# EAGLE schematic audino1012 (EAGLE 6.2)
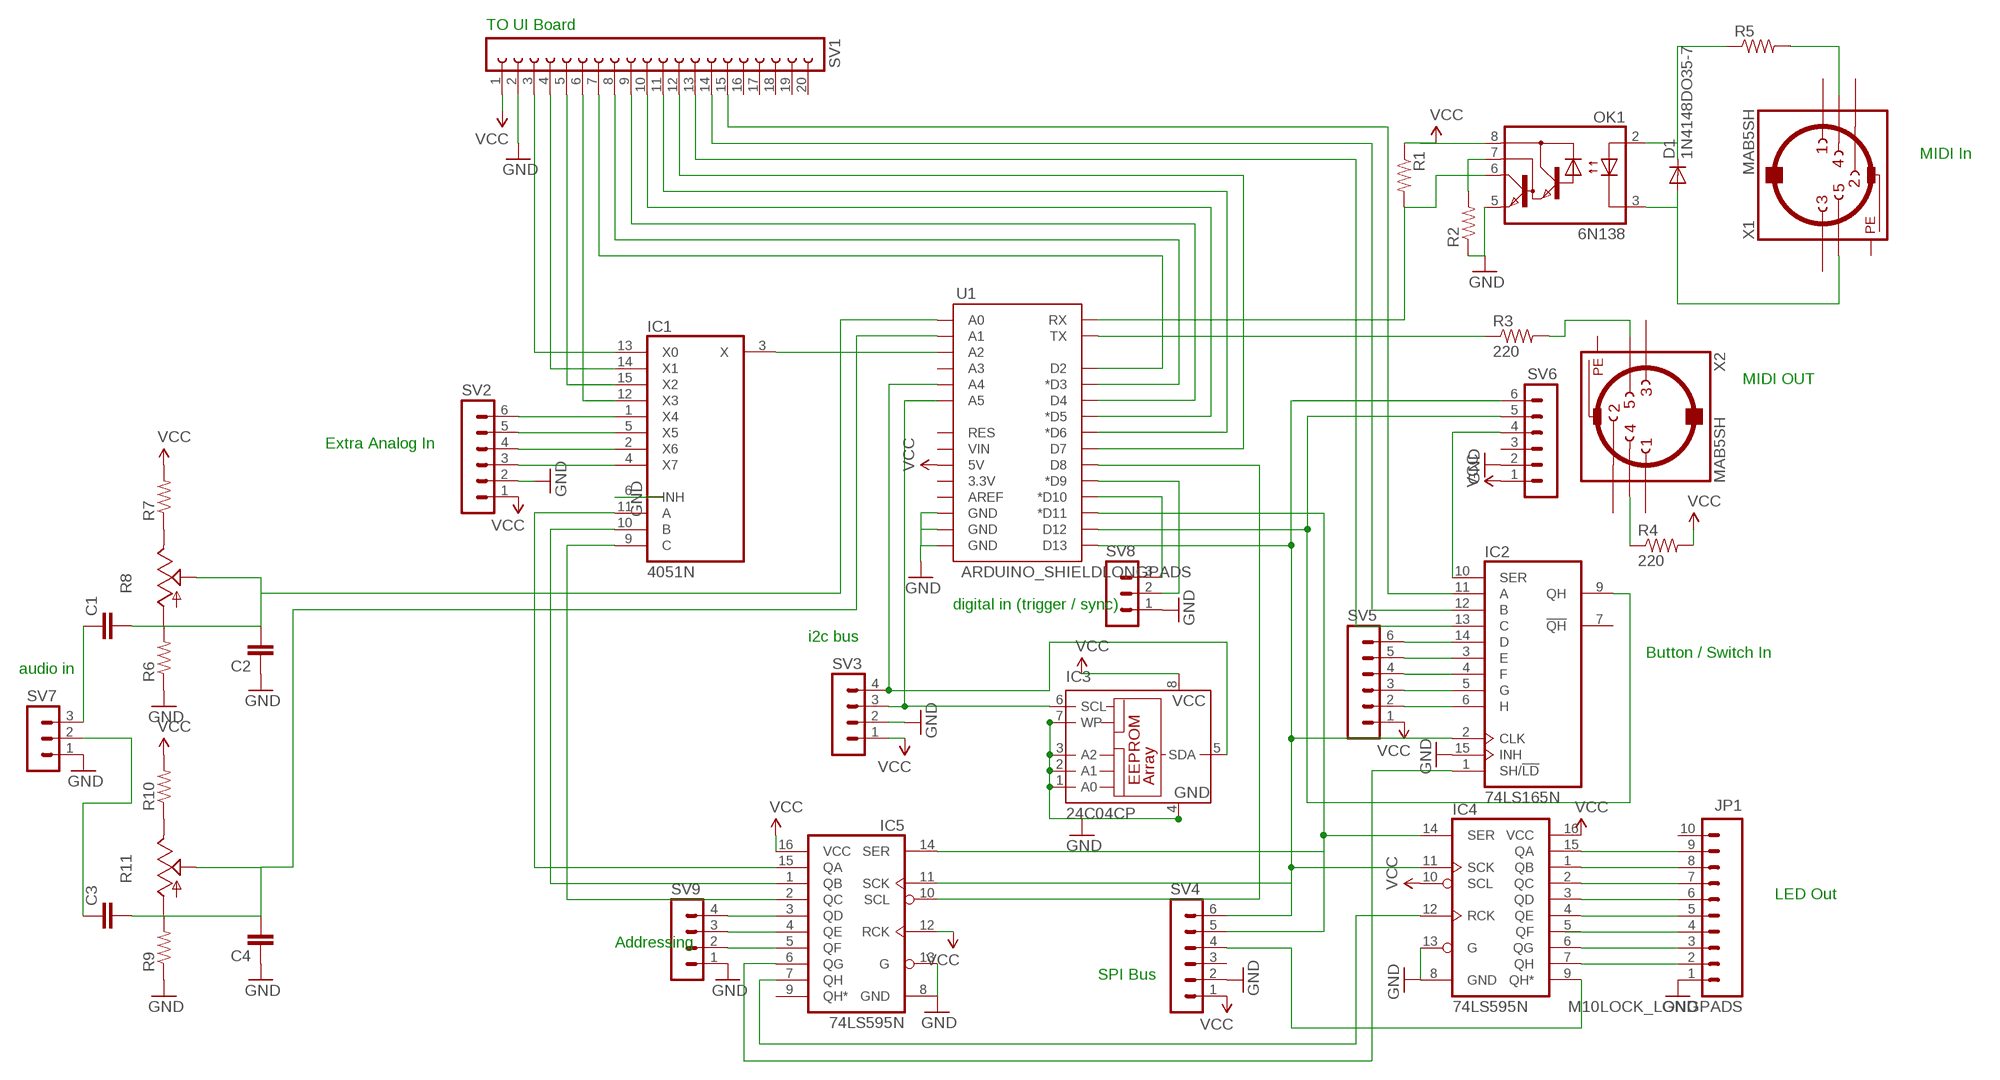
[diagram p0: schematic, sheet 1]

## Parts
C1  CAPPTH  [CAP-PTH-SMALL]
C2  CAPPTH  [CAP-PTH-SMALL]
C3  CAPPTH  [CAP-PTH-SMALL]
C4  CAPPTH  [CAP-PTH-SMALL]
D1  1N4148DO35-7  [DO35-7]
IC1  4051N  [DIL16]
IC2  74LS165N  [DIL16]
IC3  24C04CP  [DIL8]
IC4  74LS595N  [DIL16]
IC5  74LS595N  [DIL16]
JP1  M10LOCK_LONGPADS  [1X10_LOCK_LONGPADS]
OK1  6N138  [DIL08]
R1  RESISTORKIT  [AXIAL-0.3-KIT]
R2  RESISTORKIT  [AXIAL-0.3-KIT]
R3  220  RESISTORKIT  [AXIAL-0.3-KIT]
R4  220  RESISTORKIT  [AXIAL-0.3-KIT]
R5  RESISTORKIT  [AXIAL-0.3-KIT]
R6  RESISTORKIT  [AXIAL-0.3-KIT]
R7  RESISTORKIT  [AXIAL-0.3-KIT]
R8  TRIM_US-B64Y  [B64Y]
R9  RESISTORKIT  [AXIAL-0.3-KIT]
R10  RESISTORKIT  [AXIAL-0.3-KIT]
R11  TRIM_US-B64Y  [B64Y]
SV1  FE20-1  [FE20]
SV2  MA06-1  [MA06-1]
SV3  MA04-1  [MA04-1]
SV4  MA06-1  [MA06-1]
SV5  MA06-1  [MA06-1]
SV6  MA06-1  [MA06-1]
SV7  MA03-1  [MA03-1]
SV8  MA03-1  [MA03-1]
SV9  MA04-1  [MA04-1]
U1  ARDUINO_SHIELDLONGPADS  [DUEMILANOVE_SHIELD_LONGPADS]
X1  MAB5SH  [MAB5SH]
X2  MAB5SH  [MAB5SH]

## Nets
GND: C2.1 C4.1 IC1.6(INH) IC2.15(INH) IC3.1(A0) IC3.2(A1) IC3.3(A2) IC3.4(GND) IC3.7(WP) IC4.8(GND) IC4.13(G) IC5.8(GND) IC5.13(G) JP1.1 OK1.5(GND) R2.P$1 R6.P$1 R9.P$1 SV1.2 SV2.2 SV3.2 SV4.2 SV6.2 SV7.1 SV8.1 SV9.1 U1.GND@0(GND) U1.GND@1(GND) U1.GND@2(GND)
N$1: IC1.13(X0) SV1.3
N$2: IC1.14(X1) SV1.4
N$3: IC1.15(X2) SV1.5
N$4: IC1.12(X3) SV1.6
N$5: IC1.3(X) U1.A2
N$6: IC1.1(X4) SV2.6
N$7: IC1.5(X5) SV2.5
N$8: IC1.2(X6) SV2.4
N$9: IC1.4(X7) SV2.3
N$10: SV1.7 U1.D2
N$11: SV1.8 U1.D3(*D3)
N$12: SV1.9 U1.D4
N$13: SV1.10 U1.D5(*D5)
N$14: SV1.11 U1.D6(*D6)
N$15: SV1.12 U1.D7
N$16: IC3.5(SDA) SV3.4 U1.A4
N$17: IC3.6(SCL) SV3.3 U1.A5
N$18: R3.P$1 U1.TX
N$19: R3.P$2 X2.5
N$20: R4.P$1 X2.4
N$21: D1.A OK1.3(C) X1.5
N$22: D1.C OK1.2(A) R5.P$1
N$23: OK1.7(VB) R2.P$2
N$24: OK1.6(VO) R1.P$2 U1.RX
N$25: R5.P$2 X1.4
N$26: U1.A0
N$27: U1.A1
N$28: IC2.2(CLK) IC4.11(SCK) IC5.11(SCK) SV4.6 SV6.6 U1.D13
N$29: IC2.9(QH) SV6.5 U1.D12
N$30: IC4.14(SER) IC5.14(SER) SV4.5 U1.D11(*D11)
N$31: IC4.12(RCK) IC5.7(QH)
N$32: IC2.13(C) SV1.13
N$33: IC2.12(B) SV1.14
N$34: IC2.11(A) SV1.15
N$35: C1.1 SV7.3
N$36: IC4.9(QH*) SV4.4
N$37: IC4.7(QH) JP1.2
N$38: IC4.6(QG) JP1.3
N$39: JP1.4
N$40: IC4.4(QE) JP1.5
N$41: IC4.3(QD) JP1.6
N$42: IC4.2(QC) JP1.7
N$43: IC4.1(QB) JP1.8
N$44: IC4.15(QA) JP1.9
N$45: U1.D8
N$46: IC2.10(SER) SV6.4
N$47: IC2.14(D) SV5.6
N$48: IC2.3(E) SV5.5
N$49: IC2.4(F) SV5.4
N$50: IC2.5(G) SV5.3
N$51: IC2.6(H) SV5.2
N$52: IC2.1(SH/!LD) IC5.6(QG)
N$53: IC1.11(A) IC5.15(QA)
N$54: IC1.10(B) IC5.1(QB)
N$55: IC1.9(C) IC5.2(QC)
N$56: R7.P$1 R8.E
N$57: C1.2 C2.2 R6.P$2 R8.A R8.S
N$58: R10.P$1 R11.E
N$59: C3.2 C4.2 R9.P$2 R11.A R11.S
N$60: C3.1 SV7.2
N$61: SV8.3 U1.D10(*D10)
N$62: SV8.2 U1.D9(*D9)
N$63: IC5.3(QD) SV9.4
N$64: IC5.4(QE) SV9.3
N$65: IC5.5(QF) SV9.2
VCC: IC3.8(VCC) IC4.10(SCL) IC4.16(VCC) IC5.12(RCK) IC5.16(VCC) OK1.8(VCC) R1.P$1 R4.P$2 R7.P$2 R10.P$2 SV1.1 SV2.1 SV3.1 SV4.1 SV5.1 SV6.1 U1.5V
Unconnected: IC2.7(!QH) IC4.5(QF) IC5.9(QH*) IC5.10(SCL) JP1.10 SV1.16 SV1.17 SV1.18 SV1.19 SV1.20 SV4.3 SV6.3 U1.3.3V U1.A3 U1.AREF U1.RES U1.VIN X1.1 X1.2 X1.3 X2.1 X2.2 X2.3

## Notes on the sheet
- TO UI Board
- MIDI In
- MIDI OUT
- Extra Analog In
- digital in (trigger / sync)
- i2c bus
- Button / Switch In
- audio in
- LED Out
- Addressing
- SPI Bus

## Power pins joined to a net without a drawn wire
GND: IC1.8(GND) IC2.8(GND)
PE: X1.PE X1.PE@(PE) X2.PE X2.PE@(PE)
VCC: IC1.16(VCC) IC2.16(VCC)
VEE: IC1.7(VEE)

## Library data of the parts
C1-C4 = SparkFun-Passives:CAP: Capacitor Standard 0603 ceramic capacitor, and 0.1" leaded capacitor.
D1 = diode:1N4148: DIODE high speed (Philips)
IC1 = 40xx:4051: 8-channel ANALOG MULTIPLEXER
IC2 = 74xx-us:74*165: 8-bit parallel load SHIFT REGISTER
IC3 = microchip:24C*: Serial EEPROM 1 K/2 K/4 K; MPN: CAT24C04LI-G; OC_FARNELL: 1718374; OC_NEWARK: 73P4460
IC4 IC5 = SparkFun-DigitalIC:74*595: 8-bit SHIFT REGISTER, output latch
JP1 = SparkFun-Connectors:M10: Header 10 Standard 10-pin 0.1" header. Use with straight break away headers (SKU : PRT-00116), right angle break away headers (PRT-00553), swiss pins (PRT-00743), machine pins (PRT-00117), and female headers (PRT-00115).
OK1 = optocoupler:6N138: MOTOROLA OPTO COUPLER; MF: VISHAY/TELEFUNKEN; MPN: 6N138; OC_FARNELL: 9860150; OC_NEWARK: 35K5294
R1-R5 = SparkFun-Resistors:RESISTOR: Resistor Basic schematic elements and footprints for 0603, 1206, and PTH resistors.
R6 R7 R9 R10 = SparkFun-Passives:RESISTOR: Resistor Basic schematic elements and footprints for 0603, 1206, and PTH resistors.
R8 R11 = pot:TRIM_US-: POTENTIOMETER
SV1 = con-lsta:FE20-1: FEMALE HEADER; OC_FARNELL: unknown; OC_NEWARK: unknown
SV2 SV4-SV6 = con-lstb:MA06-1: PIN HEADER; OC_FARNELL: unknown; OC_NEWARK: unknown
SV3 SV9 = con-lstb:MA04-1: PIN HEADER; OC_FARNELL: unknown; OC_NEWARK: unknown
SV7 SV8 = con-lstb:MA03-1: PIN HEADER; OC_FARNELL: unknown; OC_NEWARK: unknown
U1 = SparkFun-Boards:ARDUINO_SHIELD: Arduino shield footprint
X1 X2 = con-hirschmann:MAB5SH: Female CONNECTOR 5 pins 90 deg. with shield, horizontal (DIN 41524); OC_FARNELL: 809883; OC_NEWARK: unknown